# Altium project PJ1301-002-A2.PrjPCB
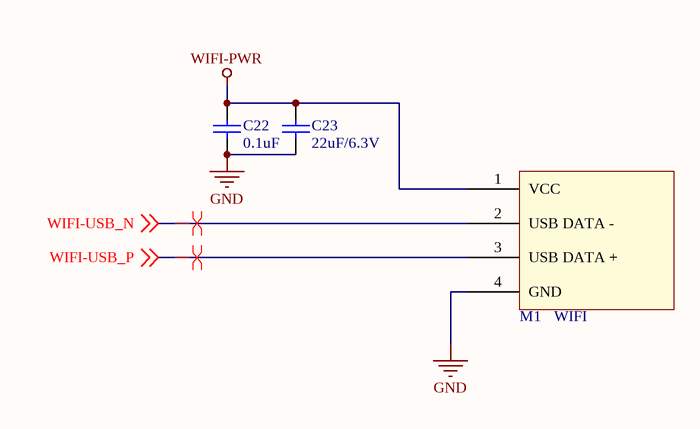
[diagram p0: wifi.SchDoc]
4 sheets, 56 parts. Net scope: global (net labels, ports and power ports of the same name join across sheets).
Board file: PJ1301-002-A2.PcbDoc
Sheets:
  wifi.SchDoc
  cellular.SchDoc
  connector.SchDoc
  gps.SchDoc

## Sheet wifi.SchDoc
size A4

### Parts
C22  0.1uF  [0603]
C23  22uF/6.3V  [0805]
M1  WIFI  [WIFI]

### Nets
GND: C22.2 C23.2 M1.4(GND)
WIFI-PWR: C22.1 C23.1 M1.1(VCC)
WIFI-USB_N: M1.2(USB_DATA_-) ; off-sheet WIFI-USB_N
WIFI-USB_P: M1.3(USB_DATA_+) ; off-sheet WIFI-USB_P

### Layout directives
differential pair: WIFI-USB_N, WIFI-USB_P

### Library data of the parts
C22 C23 = Cap: Capacitor

## Sheet cellular.SchDoc
size B
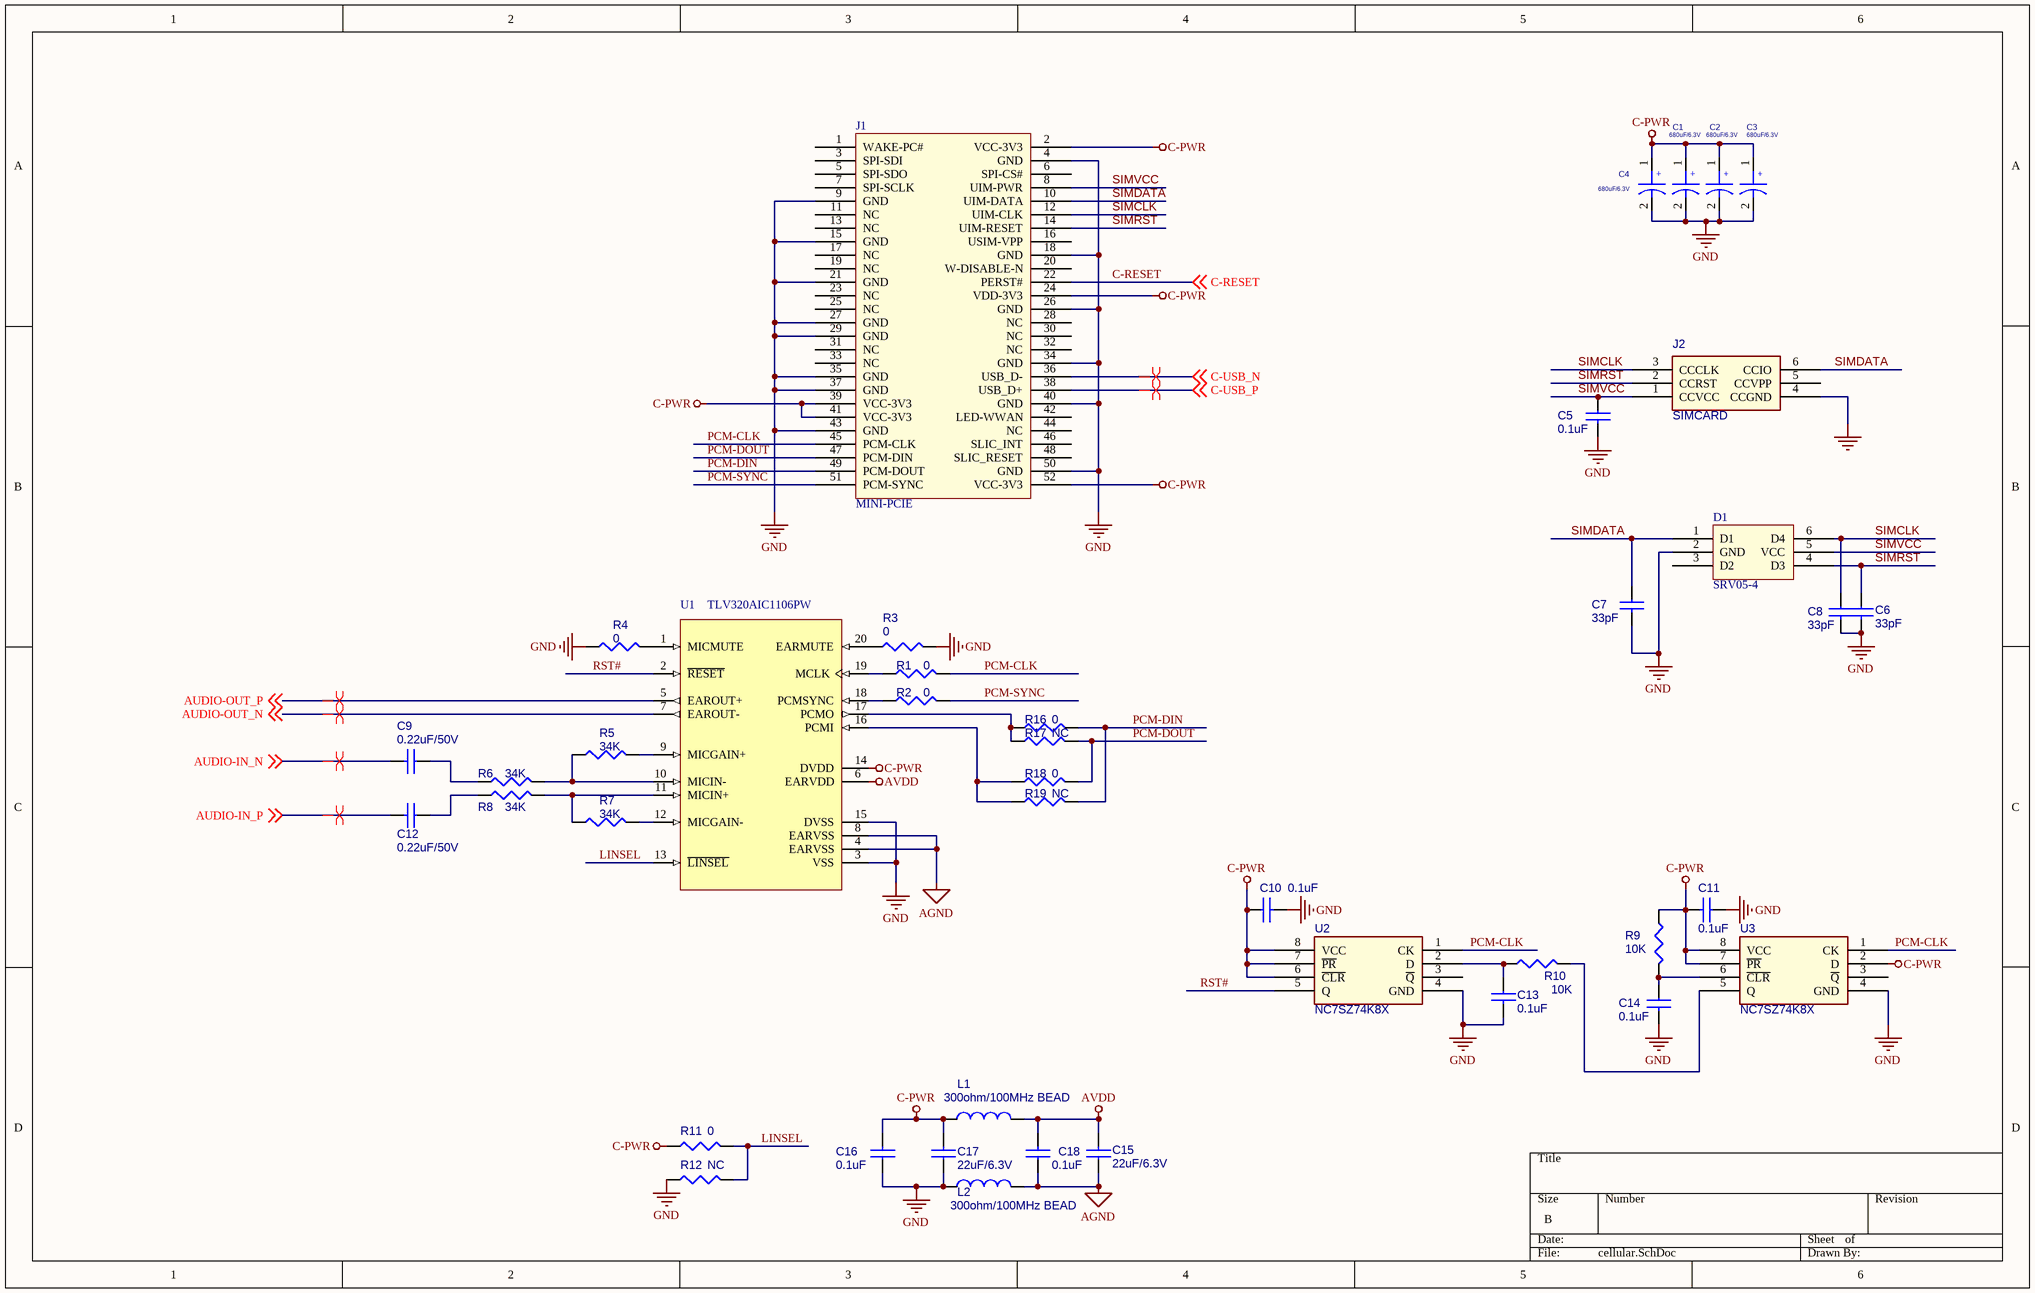
[diagram p1: cellular.SchDoc]

### Parts
C1  680uF/6.3V  [7343]
C2  680uF/6.3V  [7343]
C3  680uF/6.3V  [7343]
C4  680uF/6.3V  [7343]
C5  0.1uF  [0603]
C6  33pF  [0603]
C7  33pF  [0603]
C8  33pF  [0603]
C9  0.22uF/50V  [0603]
C10  0.1uF  [0603]
C11  0.1uF  [0603]
C12  0.22uF/50V  [0603]
C13  0.1uF  [0603]
C14  0.1uF  [0603]
C15  22uF/6.3V  [0805]
C16  0.1uF  [0603]
C17  22uF/6.3V  [0805]
C18  0.1uF  [0603]
D1  SRV05-4  [SOT23-6]
J1  MINI-PCIE
J2  SIMCARD  [SIMLOCK]
L1  300ohm/100MHz BEAD  [0603]
L2  300ohm/100MHz BEAD  [0603]
R1  0  [0603]
R2  0  [0603]
R3  0  [0603]
R4  0  [0603]
R5  34K  [0603]
R6  34K  [0603]
R7  34K  [0603]
R8  34K  [0603]
R9  10K  [0603]
R10  10K  [0603]
R11  0  [0603]
R12  NC  [0603]
R16  0  [0603]
R17  NC  [0603]
R18  0  [0603]
R19  NC  [0603]
U1  TLV320AIC1106PW  [PW020]
U2  NC7SZ74K8X  [US8]
U3  NC7SZ74K8X  [US8]

### Nets
AGND: C15.1 C18.1 L2.1 U1.4(EARVSS) U1.8(EARVSS)
AVDD: C15.2 C18.2 L1.1 U1.6(EARVDD)
C-PWR: C1.1 C2.1 C3.1 C4.1 C10.1 C11.2 C16.2 C17.2 J1.2(VCC-3V3) J1.24(VDD-3V3) J1.39(VCC-3V3) J1.41(VCC-3V3) J1.52(VCC-3V3) L1.2 R9.2 R11.2 U1.14(DVDD) U2.6(~{CLR}) U2.7(~{PR}) U2.8(VCC) U3.2(D) U3.7(~{PR}) U3.8(VCC)
GND: C1.2 C2.2 C3.2 C4.2 C5.2 C6.2 C7.2 C8.2 C10.2 C11.1 C13.2 C14.2 C16.1 C17.1 D1.2(GND) J1.4(GND) J1.9(GND) J1.15(GND) J1.18(GND) J1.21(GND) J1.26(GND) J1.27(GND) J1.29(GND) J1.34(GND) J1.35(GND) J1.37(GND) J1.40(GND) J1.43(GND) J1.50(GND) J2.4(CCGND) L2.2 R3.1 R4.2 R12.2 U1.3(VSS) U1.15(DVSS) U2.4(GND) U3.4(GND)
AUDIO-IN_N: C9.2 ; off-sheet AUDIO-IN_N
AUDIO-IN_P: C12.2 ; off-sheet AUDIO-IN_P
AUDIO-OUT_N: U1.7(EAROUT-) ; off-sheet AUDIO-OUT_N
AUDIO-OUT_P: U1.5(EAROUT+) ; off-sheet AUDIO-OUT_P
C-RESET: J1.22(PERST#) ; off-sheet C-RESET
C-USB_N: J1.36(USB_D-) ; off-sheet C-USB_N
C-USB_P: J1.38(USB_D+) ; off-sheet C-USB_P
LINSEL: R11.1 R12.1 U1.13(~{LINSEL})
PCM-CLK: J1.45(PCM-CLK) R1.1 U2.1(CK) U3.1(CK)
PCM-DIN: J1.49(PCM-DOUT) R16.1 R19.1
PCM-DOUT: J1.47(PCM-DIN) R17.1 R18.1
PCM-SYNC: J1.51(PCM-SYNC) R2.1
RST#: U1.2(~{RESET}) U2.5(Q)
SIMCLK: C8.1 D1.6(D4) J1.12(UIM-CLK) J2.3(CCCLK)
SIMDATA: C7.1 D1.1(D1) J1.10(UIM-DATA) J2.6(CCIO)
SIMRST: C6.1 D1.4(D3) J1.14(UIM-RESET) J2.2(CCRST)
SIMVCC: C5.1 D1.5(VCC) J1.8(UIM-PWR) J2.1(CCVCC)
NetC9_1: C9.1 R6.2
NetC12_1: C12.1 R8.2
NetC13_1: C13.1 R10.2 U2.2(D)
NetC14_1: C14.1 R9.1 U3.6(~{CLR})
NetR1_2: R1.2 U1.19(MCLK)
NetR2_2: R2.2 U1.18(PCMSYNC)
NetR3_2: R3.2 U1.20(EARMUTE)
NetR4_1: R4.1 U1.1(MICMUTE)
NetR5_1: R5.1 U1.9(MICGAIN+)
NetR5_2: R5.2 R6.1 U1.10(MICIN-)
NetR7_1: R7.1 U1.12(MICGAIN-)
NetR7_2: R7.2 R8.1 U1.11(MICIN+)
NetR10_1: R10.1 U3.5(Q)
NetR16_2: R16.2 R17.2 U1.17(PCMO)
NetR18_2: R18.2 R19.2 U1.16(PCMI)

Not connected (* = marked no-connect by the designer): D1 3(D2); J1 1(WAKE-PC#) 3(SPI-SDI) 5(SPI-SDO) 6(SPI-CS#) 7(SPI-SCLK) 11(NC) 13(NC) 16(USIM-VPP) 17(NC) 19(NC) 20(W-DISABLE-N) 23(NC) 25(NC) 28(NC) 30(NC) 31(NC) 32(NC) 33(NC) 42(LED-WWAN) 44(NC) 46(SLIC_INT) 48(SLIC_RESET); J2 5(CCVPP); U2 3(~{Q}); U3 3(~{Q})

### Layout directives
differential pair: AUDIO-IN_N, AUDIO-IN_P, AUDIO-OUT_N, AUDIO-OUT_P, C-USB_N, C-USB_P

### Notes on the sheet
- (in symbol 10U-6032-20V) +

### Library data of the parts
C1-C4 = 10U-6032-20V: CAP;10U  ,TT,20V ,20%,6032,SMT
C5-C18 = P_CAP NP
L1 L2 = INDUCTOR_4
R1-R12 R16-R19 = P_R
U1 = TLV320AIC1106PWG4: PCM CODEC With Microphone Amps & Speaker Driver, 20-Pin TSSOP; Published: 16-Dec-2005; DatasheetVersion: 13-Sep-2005; PackageVersion: Feb-1999; PackageReference: PW020; Publisher: Altium Limited; PackageDescription: Shrink Small Outline; 20 Leads; Body Width 4.4 mm; Pitch 0.65 mm; ComponentLink1Description: Manufacturer Link; ComponentLink1URL: http://www.ti.com/; ComponentLink2Description: Datasheet; ComponentLink2URL: http://focus.ti.com/lit/ds/symlink/tlv320aic1106.pdf
U2 U3 = NC7SZ74-US8_0: IC;NC7SZ74,D-TYPE FLIP-FLOP,US8; VENDER: FAIRCHILD; P/N: XXXXXXXXXXXX; PKG: US8; device: US8

## Sheet connector.SchDoc
size A4
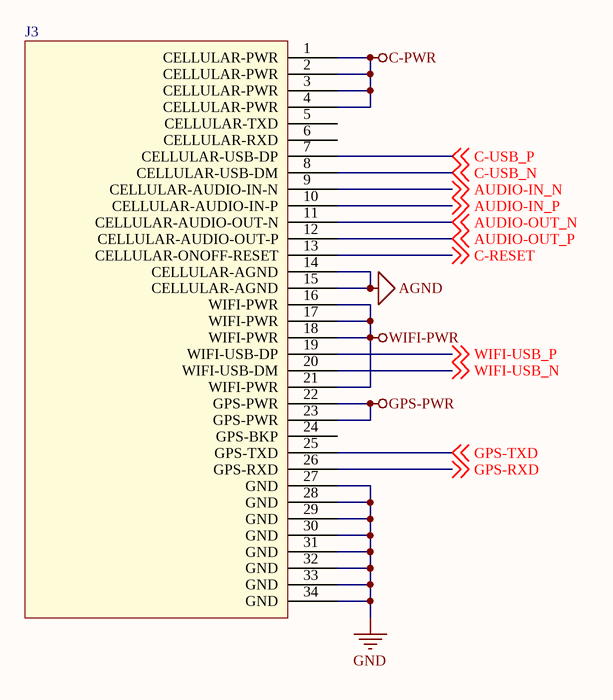
[diagram p2: connector.SchDoc]

### Parts
J3  COMM_BOARD  [HEAD_2MM_2X17]  (value not drawn)

### Nets
AGND: J3.14(CELLULAR-AGND) J3.15(CELLULAR-AGND)
C-PWR: J3.1(CELLULAR-PWR) J3.2(CELLULAR-PWR) J3.3(CELLULAR-PWR) J3.4(CELLULAR-PWR)
GND: J3.27(GND) J3.28(GND) J3.29(GND) J3.30(GND) J3.31(GND) J3.32(GND) J3.33(GND) J3.34(GND)
GPS-PWR: J3.22(GPS-PWR) J3.23(GPS-PWR)
WIFI-PWR: J3.16(WIFI-PWR) J3.17(WIFI-PWR) J3.18(WIFI-PWR) J3.21(WIFI-PWR)
AUDIO-IN_N: J3.9(CELLULAR-AUDIO-IN-N) ; off-sheet AUDIO-IN_N
AUDIO-IN_P: J3.10(CELLULAR-AUDIO-IN-P) ; off-sheet AUDIO-IN_P
AUDIO-OUT_N: J3.11(CELLULAR-AUDIO-OUT-N) ; off-sheet AUDIO-OUT_N
AUDIO-OUT_P: J3.12(CELLULAR-AUDIO-OUT-P) ; off-sheet AUDIO-OUT_P
C-RESET: J3.13(CELLULAR-ONOFF-RESET) ; off-sheet C-RESET
C-USB_N: J3.8(CELLULAR-USB-DM) ; off-sheet C-USB_N
C-USB_P: J3.7(CELLULAR-USB-DP) ; off-sheet C-USB_P
GPS-RXD: J3.26(GPS-RXD) ; off-sheet GPS-RXD
GPS-TXD: J3.25(GPS-TXD) ; off-sheet GPS-TXD
WIFI-USB_N: J3.20(WIFI-USB-DM) ; off-sheet WIFI-USB_N
WIFI-USB_P: J3.19(WIFI-USB-DP) ; off-sheet WIFI-USB_P

Not connected (* = marked no-connect by the designer): J3 5(CELLULAR-TXD) 6(CELLULAR-RXD) 24(GPS-BKP)

## Sheet gps.SchDoc
size A4
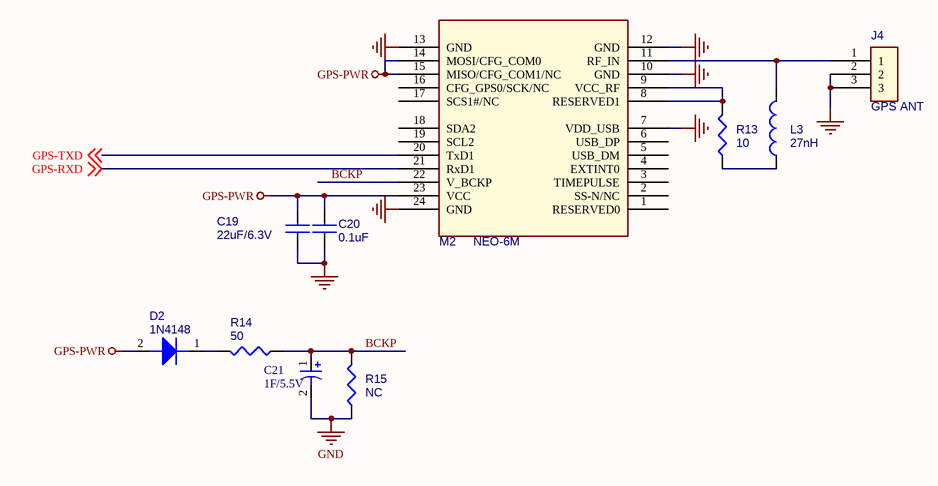
[diagram p3: gps.SchDoc]

### Parts
C19  22uF/6.3V  [0805]
C20  0.1uF  [0603]
C21  1F/5.5V  [SCAP]
D2  1N4148  [MINI-MELF]
J4  GPS ANT  [ANT]
L3  27nH  [0603]
M2  NEO-6M  [NEO-6]
R13  10  [0603]
R14  50  [0603]
R15  NC  [0603]

### Nets
GND: C19.2 C20.2 C21.2 J4.2 J4.3 M2.7(VDD_USB) M2.10(GND) M2.12(GND) M2.13(GND) M2.24(GND) R15.1
GPS-PWR: C19.1 C20.1 D2.2 M2.14(MOSI/CFG_COM0) M2.15(MISO/CFG_COM1/NC) M2.23(VCC)
BCKP: C21.1 M2.22(V_BCKP) R14.1 R15.2
GPS-RXD: M2.21(RxD1) ; off-sheet GPS-RXD
GPS-TXD: M2.20(TxD1) ; off-sheet GPS-TXD
NetD2_1: D2.1 R14.2
NetJ4_1: J4.1 L3.2 M2.11(RF_IN)
NetL3_1: L3.1 R13.1
NetM2_8: M2.8(RESERVED1) M2.9(VCC_RF) R13.2

Not connected (* = marked no-connect by the designer): M2 1(RESERVED0) 2(SS-N/NC) 3(TIMEPULSE) 4(EXTINT0) 5(USB_DM) 6(USB_DP) 16(CFG_GPS0/SCK/NC) 17(SCS1#/NC) 18(SDA2) 19(SCL2)

### Library data of the parts
C19 C20 = P_CAP NP
C21 = Cap Pol1: Polarized Capacitor (Radial)
D2 = 1N4148WS-7-F_SOD323-2
J4 = HRS_U_0.FL-R-SMT-10
L3 = 2.2UH_LPS3015-222MLC_1.5A_20%~D
M2 = NEO-5M
R13-R15 = P_R

## Nets that join several sheets
AGND: cellular (5 pins), connector (J3.14 J3.15)
C-PWR: cellular (23 pins), connector (J3.1 J3.2 J3.3 J3.4)
GND: wifi (C22.2 C23.2 M1.4), cellular (38 pins), connector (8 pins), gps (11 pins)
GPS-PWR: connector (J3.22 J3.23), gps (6 pins)
WIFI-PWR: wifi (C22.1 C23.1 M1.1), connector (J3.16 J3.17 J3.18 J3.21)
AUDIO-IN_N: cellular (C9.2), connector (J3.9)
AUDIO-IN_P: cellular (C12.2), connector (J3.10)
AUDIO-OUT_N: cellular (U1.7), connector (J3.11)
AUDIO-OUT_P: cellular (U1.5), connector (J3.12)
C-RESET: cellular (J1.22), connector (J3.13)
C-USB_N: cellular (J1.36), connector (J3.8)
C-USB_P: cellular (J1.38), connector (J3.7)
GPS-RXD: connector (J3.26), gps (M2.21)
GPS-TXD: connector (J3.25), gps (M2.20)
WIFI-USB_N: wifi (M1.2), connector (J3.20)
WIFI-USB_P: wifi (M1.3), connector (J3.19)